# EAGLE design haptic-glove-2.1 (EAGLE 9.6.2)
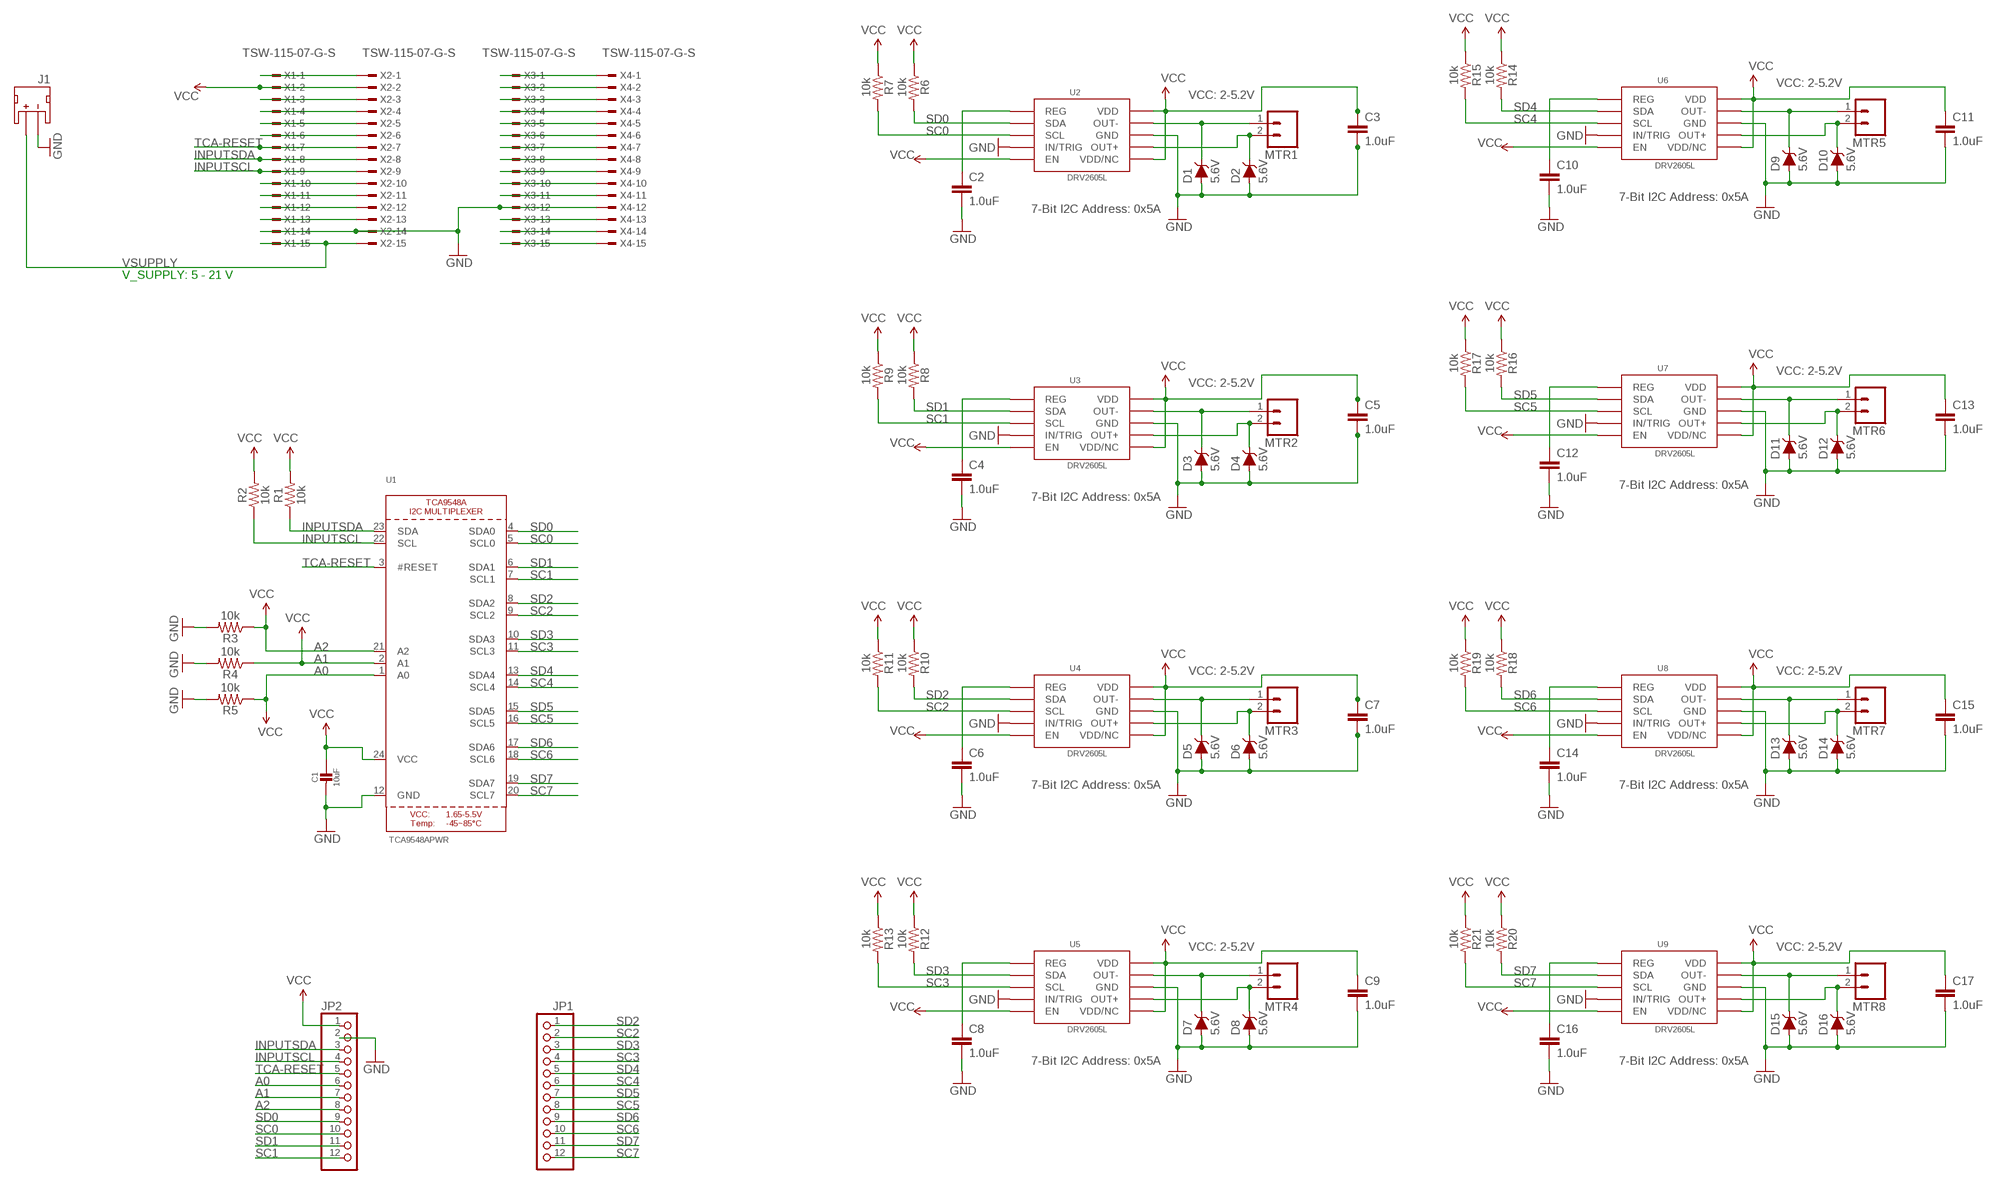
[diagram p0: schematic, sheet 1]

## Parts
C1  10uF  CAP_CERAMIC0805-NOOUTLINE  [0805-NO]
C2  1.0uF  1.0UF-16V-10%(0402)  [0402-CAP]
C3  1.0uF  1.0UF-16V-10%(0402)  [0402-CAP]
C4  1.0uF  1.0UF-16V-10%(0402)  [0402-CAP]
C5  1.0uF  1.0UF-16V-10%(0402)  [0402-CAP]
C6  1.0uF  1.0UF-16V-10%(0402)  [0402-CAP]
C7  1.0uF  1.0UF-16V-10%(0402)  [0402-CAP]
C8  1.0uF  1.0UF-16V-10%(0402)  [0402-CAP]
C9  1.0uF  1.0UF-16V-10%(0402)  [0402-CAP]
C10  1.0uF  1.0UF-16V-10%(0402)  [0402-CAP]
C11  1.0uF  1.0UF-16V-10%(0402)  [0402-CAP]
C12  1.0uF  1.0UF-16V-10%(0402)  [0402-CAP]
C13  1.0uF  1.0UF-16V-10%(0402)  [0402-CAP]
C14  1.0uF  1.0UF-16V-10%(0402)  [0402-CAP]
C15  1.0uF  1.0UF-16V-10%(0402)  [0402-CAP]
C16  1.0uF  1.0UF-16V-10%(0402)  [0402-CAP]
C17  1.0uF  1.0UF-16V-10%(0402)  [0402-CAP]
D1  5.6V  DIODE-ZENER-MMSZ5232BS  [SOD-323]
D2  5.6V  DIODE-ZENER-MMSZ5232BS  [SOD-323]
D3  5.6V  DIODE-ZENER-MMSZ5232BS  [SOD-323]
D4  5.6V  DIODE-ZENER-MMSZ5232BS  [SOD-323]
D5  5.6V  DIODE-ZENER-MMSZ5232BS  [SOD-323]
D6  5.6V  DIODE-ZENER-MMSZ5232BS  [SOD-323]
D7  5.6V  DIODE-ZENER-MMSZ5232BS  [SOD-323]
D8  5.6V  DIODE-ZENER-MMSZ5232BS  [SOD-323]
D9  5.6V  DIODE-ZENER-MMSZ5232BS  [SOD-323]
D10  5.6V  DIODE-ZENER-MMSZ5232BS  [SOD-323]
D11  5.6V  DIODE-ZENER-MMSZ5232BS  [SOD-323]
D12  5.6V  DIODE-ZENER-MMSZ5232BS  [SOD-323]
D13  5.6V  DIODE-ZENER-MMSZ5232BS  [SOD-323]
D14  5.6V  DIODE-ZENER-MMSZ5232BS  [SOD-323]
D15  5.6V  DIODE-ZENER-MMSZ5232BS  [SOD-323]
D16  5.6V  DIODE-ZENER-MMSZ5232BS  [SOD-323]
J1  JST_2MM_MALE  [JST-2-SMD]
JP1  HEADER-1X12  [1X12_ROUND]
JP2  HEADER-1X12  [1X12_ROUND]
MTR1  M02PTH  [1X02@1]
MTR2  M02PTH  [1X02@1]
MTR3  M02PTH  [1X02@1]
MTR4  M02PTH  [1X02@1]
MTR5  M02PTH  [1X02@1]
MTR6  M02PTH  [1X02@1]
MTR7  M02PTH  [1X02@1]
MTR8  M02PTH  [1X02@1]
R1  10k  10KOHM-0603-1/10W-1%  [0603]
R2  10k  10KOHM-0603-1/10W-1%  [0603]
R3  10k  10KOHM-0603-1/10W-1%  [0603]
R4  10k  10KOHM-0603-1/10W-1%  [0603]
R5  10k  10KOHM-0603-1/10W-1%  [0603]
R6  10k  10KOHM-0603-1/10W-1%  [0603]
R7  10k  10KOHM-0603-1/10W-1%  [0603]
R8  10k  10KOHM-0603-1/10W-1%  [0603]
R9  10k  10KOHM-0603-1/10W-1%  [0603]
R10  10k  10KOHM-0603-1/10W-1%  [0603]
R11  10k  10KOHM-0603-1/10W-1%  [0603]
R12  10k  10KOHM-0603-1/10W-1%  [0603]
R13  10k  10KOHM-0603-1/10W-1%  [0603]
R14  10k  10KOHM-0603-1/10W-1%  [0603]
R15  10k  10KOHM-0603-1/10W-1%  [0603]
R16  10k  10KOHM-0603-1/10W-1%  [0603]
R17  10k  10KOHM-0603-1/10W-1%  [0603]
R18  10k  10KOHM-0603-1/10W-1%  [0603]
R19  10k  10KOHM-0603-1/10W-1%  [0603]
R20  10k  10KOHM-0603-1/10W-1%  [0603]
R21  10k  10KOHM-0603-1/10W-1%  [0603]
U1  TCA9548APWR  TCA9548A  [TSSOP24]
U2  DRV2605L  [VSSOP-10]
U3  DRV2605L  [VSSOP-10]
U4  DRV2605L  [VSSOP-10]
U5  DRV2605L  [VSSOP-10]
U6  DRV2605L  [VSSOP-10]
U7  DRV2605L  [VSSOP-10]
U8  DRV2605L  [VSSOP-10]
U9  DRV2605L  [VSSOP-10]
X1  TSW-115-07-G-S  [TSW-115-XX-G-S]
X2  TSW-115-07-G-S  [TSW-115-XX-G-S]
X3  TSW-115-07-G-S  [TSW-115-XX-G-S]
X4  TSW-115-07-G-S  [TSW-115-XX-G-S]

## Nets
A0: JP2.6 R5.1 U1.1(A0) ; supply symbol labelled VCC
A1: JP2.7 R4.1 U1.2(A1) ; supply symbol labelled VCC
A2: JP2.8 R3.1 U1.21(A2) ; supply symbol labelled VCC
EN1: X3.2 X4.2
EN2: X3.4 X4.4
EN3: X3.8 X4.8
EN4: X3.11 X4.11
GND: C1.2 C2.2 C3.2 C4.2 C5.2 C6.2 C7.2 C8.2 C9.2 C10.2 C11.2 C12.2 C13.2 C14.2 C15.2 C16.2 C17.2 D1.A D2.A D3.A D4.A D5.A D6.A D7.A D8.A D9.A D10.A D11.A D12.A D13.A D14.A D15.A D16.A J1.1(-) JP2.2 R3.2 R4.2 R5.2 U1.12(GND) U2.P$4(IN/TRIG) U2.P$8(GND) U3.P$4(IN/TRIG) U3.P$8(GND) U4.P$4(IN/TRIG) U4.P$8(GND) U5.P$4(IN/TRIG) U5.P$8(GND) U6.P$4(IN/TRIG) U6.P$8(GND) U7.P$4(IN/TRIG) U7.P$8(GND) U8.P$4(IN/TRIG) U8.P$8(GND) U9.P$4(IN/TRIG) U9.P$8(GND) X1.14 X2.14 X3.12 X4.12
IN/TRIG1: X3.1 X4.1
IN/TRIG2: X3.3 X4.3
IN/TRIG3: X3.7 X4.7
IN/TRIG4: X3.10 X4.10
IN/TRIG5: X1.6 X2.6
INPUTSCL: JP2.4 R2.1 U1.22(SCL) X1.9 X2.9
INPUTSDA: JP2.3 R1.1 U1.23(SDA) X1.8 X2.8
N$1: C4.1 U3.P$1(REG)
N$2: C10.1 U6.P$1(REG)
N$3: D9.C MTR5.1 U6.P$9(OUT-)
N$4: D3.C MTR2.1 U3.P$9(OUT-)
N$5: D4.C MTR2.2 U3.P$7(OUT+)
N$6: C8.1 U5.P$1(REG)
N$7: D10.C MTR5.2 U6.P$7(OUT+)
N$8: X1.1 X2.1
N$9: D7.C MTR4.1 U5.P$9(OUT-)
N$10: D8.C MTR4.2 U5.P$7(OUT+)
N$11: C6.1 U4.P$1(REG)
N$13: X1.3 X2.3
N$14: D5.C MTR3.1 U4.P$9(OUT-)
N$15: D6.C MTR3.2 U4.P$7(OUT+)
N$16: C12.1 U7.P$1(REG)
N$17: X1.4 X2.4
N$18: D11.C MTR6.1 U7.P$9(OUT-)
N$19: D12.C MTR6.2 U7.P$7(OUT+)
N$20: C14.1 U8.P$1(REG)
N$21: X1.5 X2.5
N$22: D13.C MTR7.1 U8.P$9(OUT-)
N$23: D14.C MTR7.2 U8.P$7(OUT+)
N$24: C16.1 U9.P$1(REG)
N$25: D15.C MTR8.1 U9.P$9(OUT-)
N$26: D16.C MTR8.2 U9.P$7(OUT+)
N$28: C2.1 U2.P$1(REG)
N$29: X1.10 X2.10
N$30: X1.11 X2.11
N$31: D1.C MTR1.1 U2.P$9(OUT-)
N$32: D2.C MTR1.2 U2.P$7(OUT+)
N$34: X1.12 X2.12
N$35: X1.13 X2.13
N$46: X3.5 X4.5
N$47: X3.6 X4.6
N$50: X3.9 X4.9
N$55: X3.13 X4.13
N$58: X3.14 X4.14
N$59: X3.15 X4.15
SC0: JP2.10 R7.2 U1.5(SCL0) U2.P$2(SCL)
SC1: JP2.12 R9.2 U1.7(SCL1) U3.P$2(SCL)
SC2: JP1.2 R11.2 U1.9(SCL2) U4.P$2(SCL)
SC3: JP1.4 R13.2 U1.11(SCL3) U5.P$2(SCL)
SC4: JP1.6 R15.2 U1.14(SCL4) U6.P$2(SCL)
SC5: JP1.8 R17.2 U1.16(SCL5) U7.P$2(SCL)
SC6: JP1.10 R19.2 U1.18(SCL6) U8.P$2(SCL)
SC7: JP1.12 R21.2 U1.20(SCL7) U9.P$2(SCL)
SD0: JP2.9 R6.2 U1.4(SDA0) U2.P$3(SDA)
SD1: JP2.11 R8.2 U1.6(SDA1) U3.P$3(SDA)
SD2: JP1.1 R10.2 U1.8(SDA2) U4.P$3(SDA)
SD3: JP1.3 R12.2 U1.10(SDA3) U5.P$3(SDA)
SD4: JP1.5 R14.2 U1.13(SDA4) U6.P$3(SDA)
SD5: JP1.7 R16.2 U1.15(SDA5) U7.P$3(SDA)
SD6: JP1.9 R18.2 U1.17(SDA6) U8.P$3(SDA)
SD7: JP1.11 R20.2 U1.19(SDA7) U9.P$3(SDA)
TCA-RESET: JP2.5 U1.3(#RESET) X1.7 X2.7
VCC: C1.1 C3.1 C5.1 C7.1 C9.1 C11.1 C13.1 C15.1 C17.1 JP2.1 R1.2 R2.2 R6.1 R7.1 R8.1 R9.1 R10.1 R11.1 R12.1 R13.1 R14.1 R15.1 R16.1 R17.1 R18.1 R19.1 R20.1 R21.1 U1.24(VCC) U2.P$5(EN) U2.P$6(VDD/NC) U2.P$10(VDD) U3.P$5(EN) U3.P$6(VDD/NC) U3.P$10(VDD) U4.P$5(EN) U4.P$6(VDD/NC) U4.P$10(VDD) U5.P$5(EN) U5.P$6(VDD/NC) U5.P$10(VDD) U6.P$5(EN) U6.P$6(VDD/NC) U6.P$10(VDD) U7.P$5(EN) U7.P$6(VDD/NC) U7.P$10(VDD) U8.P$5(EN) U8.P$6(VDD/NC) U8.P$10(VDD) U9.P$5(EN) U9.P$6(VDD/NC) U9.P$10(VDD) X1.2 X2.2
VSUPPLY: J1.2(+) X1.15 X2.15
Unconnected: J1.NC1(PAD1) J1.NC2(PAD2)

## Notes on the sheet
- VCC: 2-5.2V
- VCC: 2-5.2V
- 7-Bit I2C Address: 0x5A
- 7-Bit I2C Address: 0x5A
- V_SUPPLY: 5 - 21 V
- VCC: 2-5.2V
- VCC: 2-5.2V
- 7-Bit I2C Address: 0x5A
- 7-Bit I2C Address: 0x5A
- VCC: 2-5.2V | VCC: 2-5.2V
- 7-Bit I2C Address: 0x5A | 7-Bit I2C Address: 0x5A
- VCC: 2-5.2V | VCC: 2-5.2V
- 7-Bit I2C Address: 0x5A | 7-Bit I2C Address: 0x5A

## Library data of the parts
C1 = microbuilder:CAP_CERAMIC: Ceramic Capacitors For new designs, use the packages preceded by an '_' character since they are more reliable: The following footprints should be used on most boards: _0402 - Standard footprint for regular board layouts _0603 - Standard footprint for regular board layouts _0805 - Standard footprint for regular board layouts _1206 - Standard footprint for regular board layouts For extremely tight-pitch boards where space is at a premium, the following 'micro-pitch' footprints can be used (smaller pads, no silkscreen outline, etc.): _0402MP - Micro-pitch footprint for very dense/compact boards _0603MP - Micro-pitch footprint for very dense/compact boards _0805MP - Micro-pitch footprint for very dense/compact boards _1206MP - Micro-pitch footprint for very dense/compact boards
C2-C17 = SparkFun-Capacitors:1.0UF-16V-10%(0402); MF: MURATA; MPN: GRM155R61E105KA12D; OC_NEWARK: 03AC2571; PROD_ID: CAP-12417
D1-D16 = SparkFun-DiscreteSemi:DIODE-ZENER: Zener Diode A Zener diode allows current to flow from its anode to its cathode like a normal semiconductor diode, but it also permits current to flow in the reverse direction when its "Zener voltage" is reached. - WIkipedia; PROD_ID: DIO-12442
J1 = SparkFun-Connectors:JST_2MM_MALE: JST 2MM MALE RA CONNECTOR Two pin, compact surface mount connector. Commonly used as a battery input connection point. We really like the solid locking feeling and high current rating on these small connectors. We use these all the time as battery connectors. Mates to single-cell LiPo batteries. Here is the connector we sell at SparkFun: JST Right Angle Connector - White <https://www.sparkfun.com/products/8612> (PRT-08612) Datasheet <http://www.sparkfun.com/datasheets/Prototyping/Connectors/JST-Horizontal.pdf> It was used on these SparkFun products: SparkFun MOSFET Power Controller <https://www.sparkfun.com/products/11214> (PRT-11214) SparkFun Battery Babysitter - LiPo Battery Manager <https://www.sparkfun.com/products/13777> (PRT-13777) And many, many others that required a lipo battery connection.; OC_NEWARK: unknown; PROD_ID: CONN-11443; SF_ID: PRT-08612
JP1 JP2 = microbuilder:HEADER-1X12
MTR1-MTR8 = SparkFun-Connectors:M02: Standard 2-pin 0.1" header. Use with - straight break away headers ( PRT-00116) - right angle break away headers (PRT-00553) - swiss pins (PRT-00743) - machine pins (PRT-00117) - female headers (PRT-00115) Molex polarized connector foot print use with: PRT-08233 with associated crimp pins and housings. 2.54_SCREWTERM for use with PRT-10571. 3.5mm Screw Terminal footprints for PRT-08084 5mm Screw Terminal footprints for use with PRT-08432; OC_NEWARK: unknown
R1-R21 = SparkFun-Resistors:10KOHM: 10kΩ resistor A resistor is a passive two-terminal electrical component that implements electrical resistance as a circuit element. Resistors act to reduce current flow, and, at the same time, act to lower voltage levels within circuits. - Wikipedia; OC_NEWARK: unknown; PROD_ID: RES-00824
U1 = microbuilder:TCA9548A: TCA9548A I2C Multiplexer
U2-U9 = SparkFun-PowerIC:DRV2605L; OC_NEWARK: unknown; PROD_ID: IC-13504
X1-X4 = con-samtec:TSW-115-*-G-S: THROUGH-HOLE .025" SQ POST HEADER Source: Samtec TSW.pdf; MF: Samtec Inc.; MPN: TSW-115-07-G-S

## Net classes
0 default: width 0.254 mm, drill 0.381 mm, clearance 0.178 mm

## Board
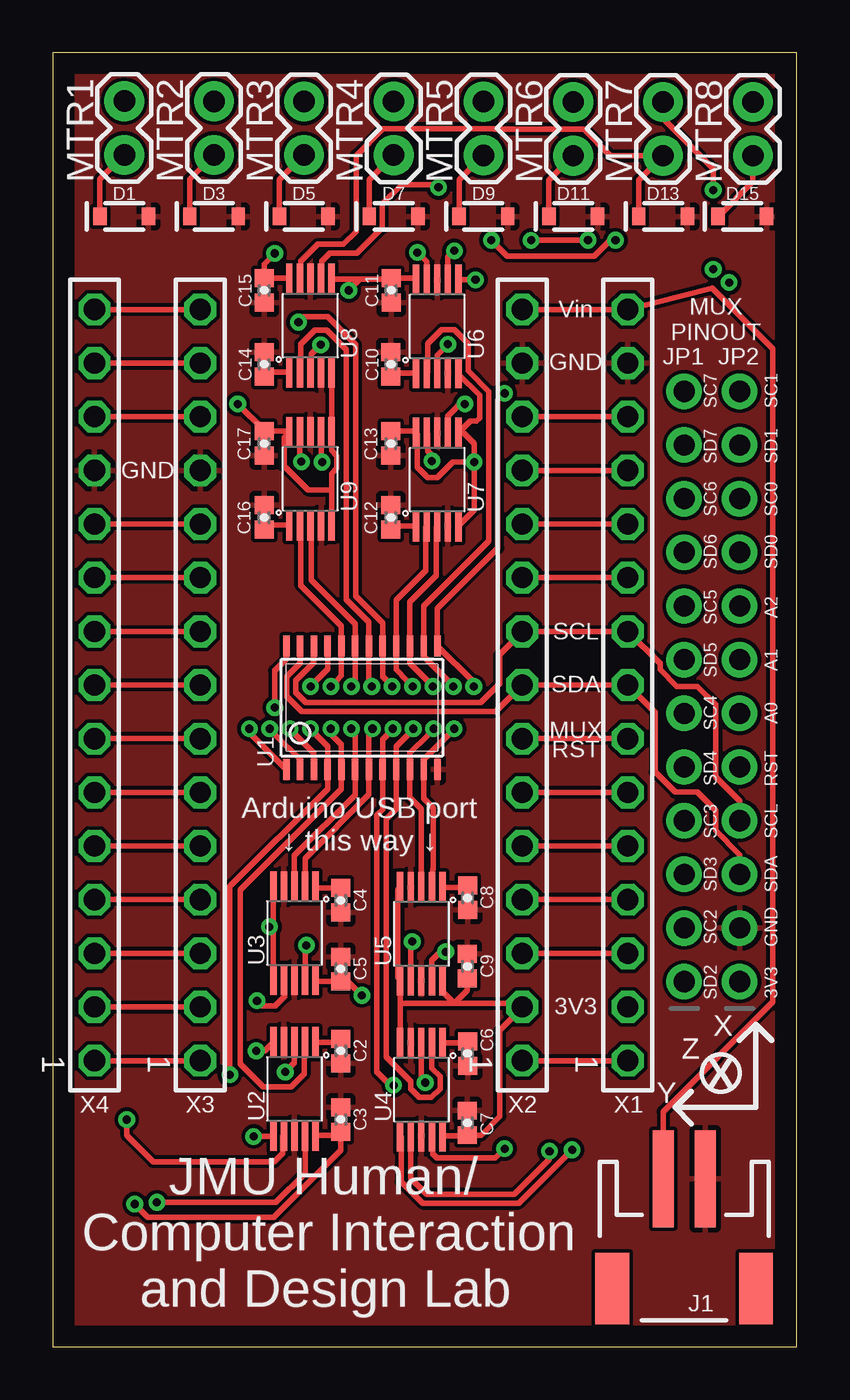
[diagram p1: board, top side]
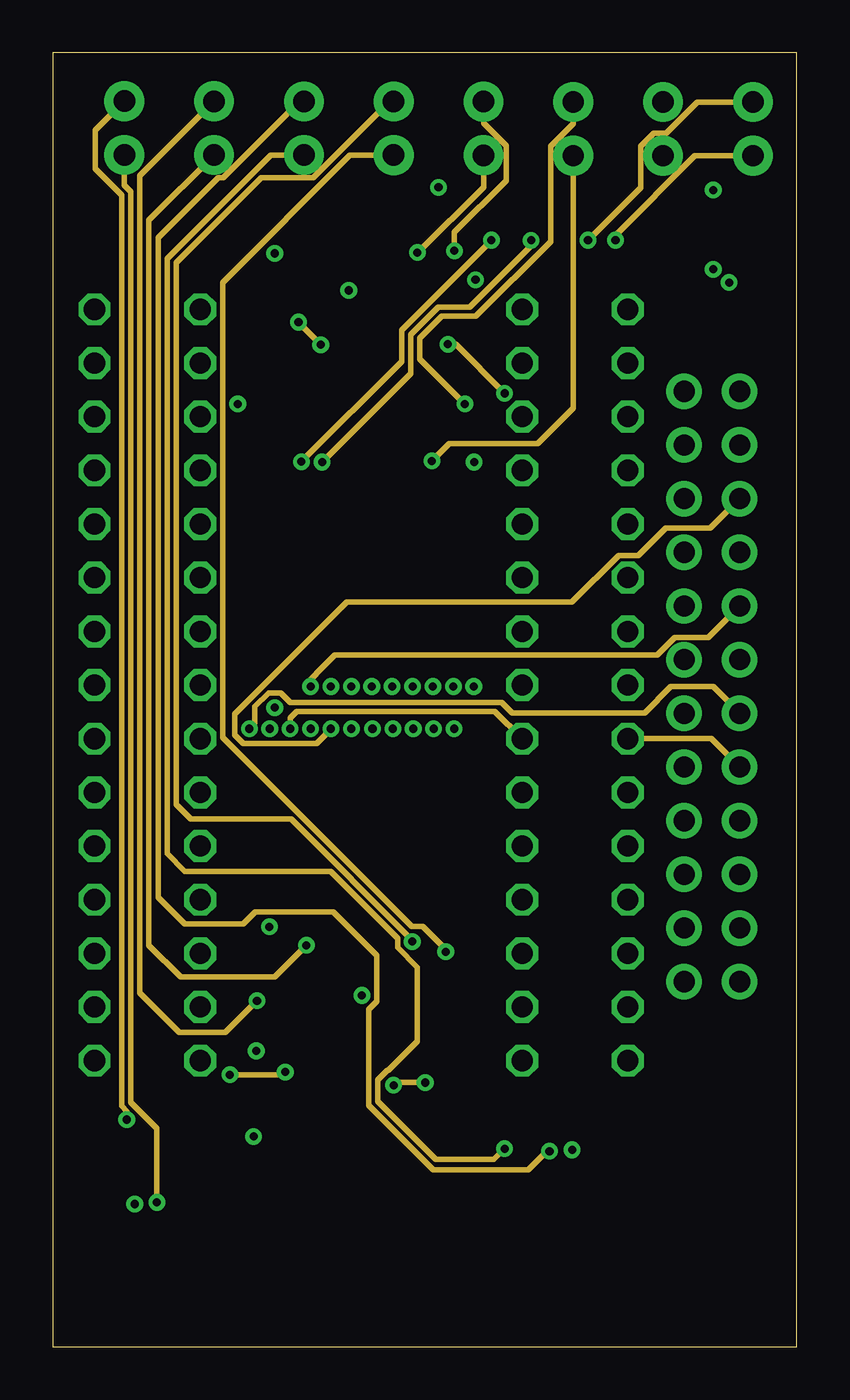
[diagram p2: board, inner layer Route2]
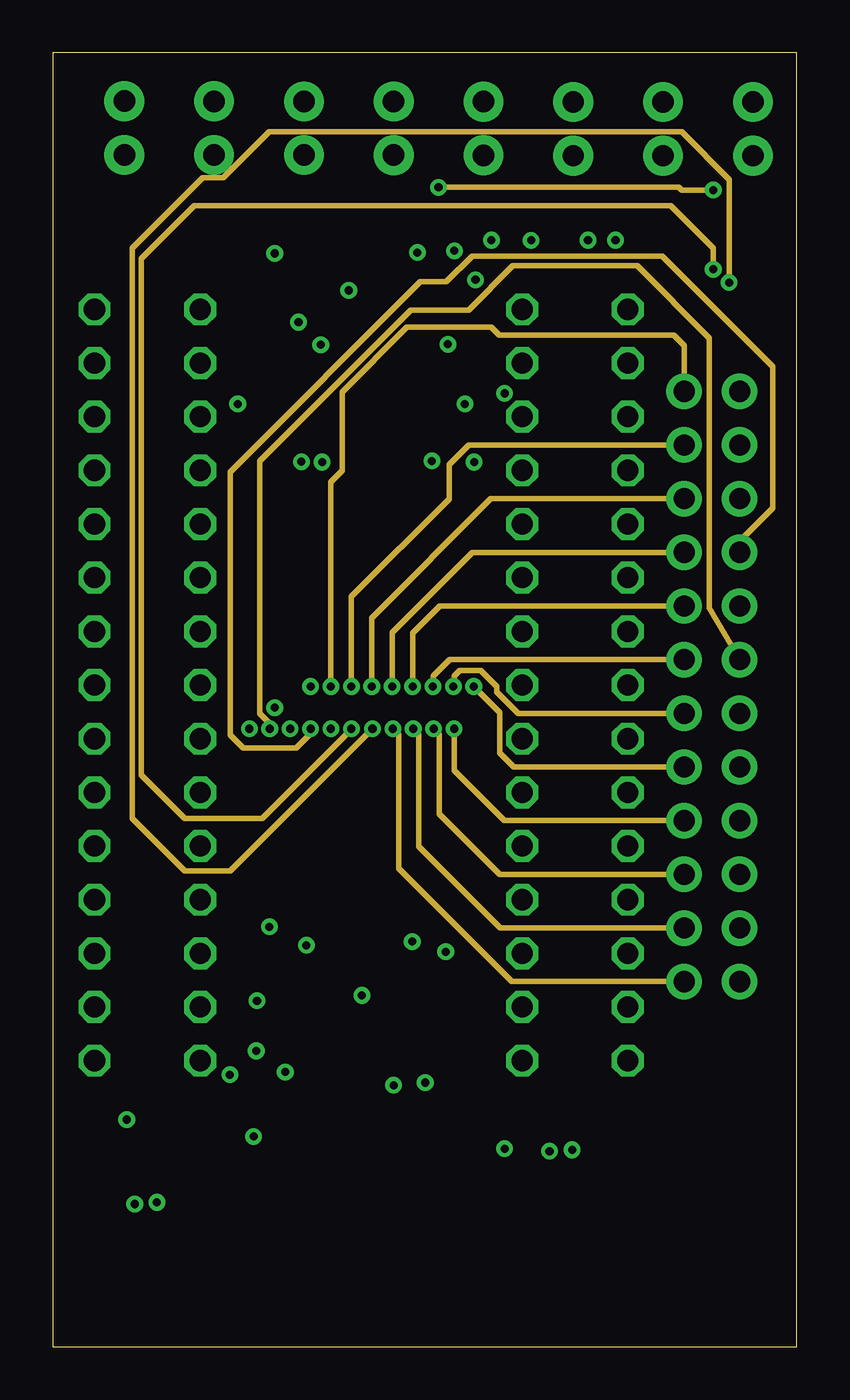
[diagram p3: board, inner layer Route15]
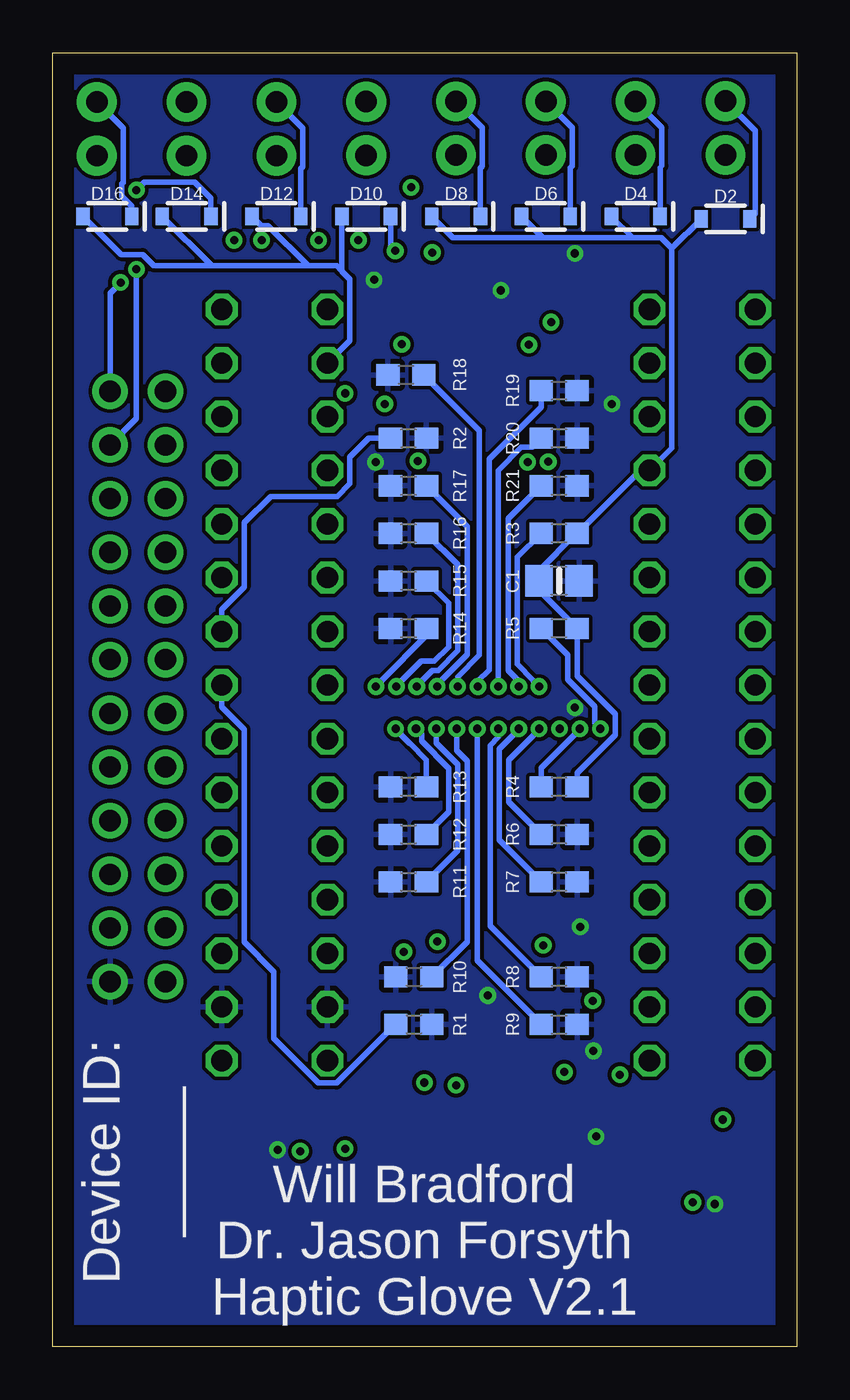
[diagram p4: board, bottom side, seen from below]

Size 35.2 x 61.24 mm. Coordinates in mm from the lower left corner, seen from the top.
Outline: 0,0 35.2,0 35.2,61.24 0,61.24 0,0
Copper layers (1+2*15+16): Top 0.035mm / dielectric 1.5mm / Route2 0.035mm / dielectric 0.15mm / Route15 0.035mm / dielectric 0.2mm / Bottom 0.035mm
Design rules "default *": minimum track width 6mil, minimum drill 0.35mm, track to track 6mil, track to pad 6mil, pad to pad 6mil, via to via 6mil, smd to smd 6mil, copper to edge 40mil, drill to drill 6mil, minimum pad ring 10mil, minimum via ring 8mil, stop-mask expansion 4mil, vias tented up to drill 0mil, thermal gap 10mil

### Footprints (pad centres in the part's own frame; a part is rotated, then mirrored left to right if it is on the bottom)
0805-NO = smd 1.3 x 1.5: 1 -0.95,0; 2 0.95,0
0402-CAP = smd 0.85 x 0.9: 1 -0.58,0; 2 0.58,0
SOD-323 = smd 0.63 x 0.83: A 1.15,0; C -1.15,0
JST-2-SMD = smd 1 x 4.6: 1 -1,-3.7; 2 1,-3.7 | smd 1.6 x 3.4: NC1 -3.4,1.5; NC2 3.4,1.5
1X12_ROUND = drill 1 pad 1.676: 1 -13.97,0; 2 -11.43,0; 3 -8.89,0; 4 -6.35,0; 5 -3.81,0; 6 -1.27,0; 7 1.27,0; 8 3.81,0; 9 6.35,0; 10 8.89,0; 11 11.43,0; 12 13.97,0
1X02@1 = drill 1.016 pad 1.88: 1 0,0; 2 2.54,0
0603 = smd 1.1 x 1: 1 -0.85,0; 2 0.85,0
TSSOP24 = smd 0.305 x 0.991: 1 -3.575,-2.918; 2 -2.925,-2.918; 3 -2.275,-2.918; 4 -1.625,-2.918; 5 -0.975,-2.918; 6 -0.325,-2.918; 7 0.325,-2.918; 8 0.975,-2.918; 9 1.625,-2.918; 10 2.275,-2.918; 11 2.925,-2.918; 12 3.575,-2.918; 13 3.575,2.918; 14 2.925,2.918; 15 2.275,2.918; 16 1.625,2.918; 17 0.975,2.918; 18 0.325,2.918; 19 -0.325,2.918; 20 -0.975,2.918; 21 -1.625,2.918; 22 -2.275,2.918; 23 -2.925,2.918; 24 -3.575,2.918
VSSOP-10 = smd 1.45 x 0.3: P$1 -1.905,1.06; P$2 -1.905,0.56; P$3 -1.905,0.06; P$4 -1.905,-0.44; P$5 -1.905,-0.94; P$6 2.495,-0.94; P$7 2.495,-0.44; P$8 2.495,0.06; P$9 2.495,0.56; P$10 2.495,1.06
TSW-115-XX-G-S = drill 1 pad 1.5 octagon: 1 17.78,0; 2 15.24,0; 3 12.7,0; 4 10.16,0; 5 7.62,0; 6 5.08,0; 7 2.54,0; 8 0,0; 9 -2.54,0; 10 -5.08,0; 11 -7.62,0; 12 -10.16,0; 13 -12.7,0; 14 -15.24,0; 15 -17.78,0

### Placement (x,y rotation side)
C1  11.25,36.25 180 bottom
C2  13.62,14 270 top
C3  13.62,10.75 90 top
C4  13.62,21.12 270 top
C5  13.62,17.88 90 top
C6  19.62,13.88 270 top
C7  19.61,10.6 90 top
C8  19.62,21.25 270 top
C9  19.61,18 90 top
C10  16,46.5 90 top
C11  16.01,50 270 top
C12  16,39.25 90 top
C13  16,42.75 270 top
C14  10,46.5 90 top
C15  10,50 270 top
C16  10,39.25 90 top
C17  10,42.75 270 top
D1  3.38,53.5 0 top
D2  3.38,53.38 180 bottom
D3  7.62,53.5 0 top
D4  7.62,53.5 180 bottom
D5  11.88,53.5 0 top
D6  11.88,53.5 180 bottom
D7  16.12,53.5 0 top
D8  16.12,53.5 180 bottom
D9  20.38,53.5 0 top
D10  20.38,53.5 180 bottom
D11  24.62,53.5 0 top
D12  24.62,53.5 180 bottom
D13  28.88,53.5 0 top
D14  28.88,53.5 180 bottom
D15  32.62,53.5 0 top
D16  32.62,53.5 180 bottom
J1  29.88,4.25 180 top
JP1  29.88,31.25 90 top
JP2  32.5,31.25 90 top
MTR1  3.38,56.41 90 top
MTR2  7.63,56.41 90 top
MTR3  11.88,56.41 90 top
MTR4  16.13,56.4 90 top
MTR5  20.38,56.4 90 top
MTR6  24.62,56.38 90 top
MTR7  28.88,56.38 90 top
MTR8  33.12,56.38 90 top
R1  18.12,15.25 0 bottom
R2  18.38,43 0 bottom
R3  11.25,38.5 0 bottom
R4  11.25,26.5 0 bottom
R5  11.25,34 0 bottom
R6  11.25,24.25 180 bottom
R7  11.25,22 180 bottom
R8  11.25,17.5 180 bottom
R9  11.25,15.25 180 bottom
R10  18.12,17.5 0 bottom
R11  18.38,22 0 bottom
R12  18.38,24.25 0 bottom
R13  18.38,26.5 0 bottom
R14  18.38,34 0 bottom
R15  18.38,36.25 0 bottom
R16  18.38,38.5 0 bottom
R17  18.38,40.75 0 bottom
R18  18.5,46 0 bottom
R19  11.25,45.25 180 bottom
R20  11.25,43 180 bottom
R21  11.25,40.75 180 bottom
U1  14.62,30.25 0 top
U2  11.38,12.5 270 top
U3  11.38,19.88 270 top
U4  17.38,12.46 270 top
U5  17.38,19.84 270 top
U6  18.25,48 90 top
U7  18.25,40.75 90 top
U8  12.25,48.03 90 top
U9  12.25,40.78 90 top
X1  27.21,31.32 270 top
X2  22.21,31.32 270 top
X3  6.97,31.32 270 top
X4  1.97,31.32 270 top

### Tracks (layer width: path | path; a pad name or v marks a point on that pad's centre or on a via)
A0  (via drill 0.38)
  Top 0.254: U1.1 9.3,29.08 v9.3,29.25
  Route2 0.254: v9.3,29.25 9.57,29.52 9.57,30.3 10.21,30.95 10.79,30.95 11.24,30.5 21.25,30.5 21.75,30 28,30 29.25,31.25 31.25,31.25 32.5,30 JP2.6
  Bottom 0.254: v9.3,29.25 9.57,29.52 9.57,30.3 10.83,31.57 10.83,32.73 R5.1
A1  (via drill 0.38)
  Top 0.254: v10.26,29.25 10.53,28.98 10.53,28.96 11.7,27.79 U1.2
  Route15 0.254: v10.26,29.25 10.26,29.5 9.8,29.96 9.8,41.91 16.95,49.06 19.67,49.06 21.77,51.16 27.65,51.16 31.06,47.74 31.06,34.96 JP2.7
  Bottom 0.254: v10.26,29.25 10.53,28.98 10.53,28.96 12.1,27.39 R4.1
A2  (via drill 0.38)
  Top 0.254: v12.2,31.25 12.46,31.52 12.46,31.54 13,32.08 U1.21
  Route2 0.254: v12.2,31.25 12.2,31.58 12.46,31.85 12.46,31.87 13.34,32.75 28.61,32.75 29.44,33.58 31.02,33.58 JP2.8
  Bottom 0.254: v12.2,31.25 12.46,31.52 12.46,31.54 13.23,32.31 13.23,37.37 R3.1
EN1
  Top 0.254: X4.2 X3.2
EN2
  Top 0.254: X4.4 X3.4
EN3
  Top 0.254: X3.8 X4.8
EN4
  Top 0.254: X3.11 X4.11
GND
  Bottom 0.254: R4.2 10.4,27.16 8.6,28.96 8.6,29.95 10.4,31.75 R5.2 12.2,35.8 C1.2 12.2,36.75 10.45,38.5 R3.2 7.42,41.48 X3.12 5.91,42.54 5.91,51.99 | D6.A 12.03,52.5 | D8.A 16.27,52.5 12.03,52.5 | D2.A 5.91,51.99 | D4.A 7.78,52.5 | 5.91,51.99 6.42,52.5 7.78,52.5 | 12.03,52.5 7.78,52.5 | D10.A 21.52,50.91 | 21.52,50.91 21.15,50.54 21.15,47.62 X2.14 | D11.A 25.35,53.07 25.03,53.07 23.12,51.16 | 21.52,50.91 21.77,51.16 23.12,51.16 | D13.A 27.68,51.16 | 27.68,51.16 23.12,51.16 | D15.A 31.97,51.7 30.96,51.7 30.42,51.16 27.68,51.16
  pour Top: -0.25,61.5 -0.25,-0.25 35.5,-0.25 35.5,61.5
IN/TRIG1
  Top 0.254: X4.1 X3.1
IN/TRIG2
  Top 0.254: X3.3 X4.3
IN/TRIG3
  Top 0.254: X3.7 X4.7
IN/TRIG4
  Top 0.254: X3.10 X4.10
IN/TRIG5
  Top 0.254: X1.6 X2.6
INPUTSCL
  Top 0.254: U1.22 12.35,32.39 11.5,31.54 11.5,30.96 11.96,30.5 20.25,30.5 21.15,31.4 21.15,32.76 22.21,33.82 X2.9 X1.9 28.73,32.34 28.73,32.05 29.53,31.25 30.5,31.25 31.36,30.39 31.36,26.97 32.5,25.82 JP2.4
  Bottom 0.254: R2.1 20.25,43 21.15,42.1 21.15,40.85 21.75,40.25 24.9,40.25 26.15,39 26.15,36 26.15,35.96 27.21,34.9 X1.9
INPUTSDA
  Top 0.254: U1.23 11.7,32.35 11.06,31.72 11.06,30.78 11.78,30.07 20.96,30.07 X2.8 X1.8 28.5,30.03 28.5,27.2 29.45,26.25 30.5,26.25 31.36,25.39 31.36,24.43 32.5,23.28 JP2.3
  Bottom 0.254: R1.1 19,15.25 21.77,12.48 22.65,12.48 24.75,14.58 24.75,17.75 26.15,19.15 26.15,29.22 27.21,30.28 X1.8
N$1
  Top 0.254: C4.1 12.51,21.7 U3.P$1
N$2
  Top 0.254: C10.1 16.18,46.09 U6.P$1
N$3  (via drill 0.38)
  Top 0.254: U6.P$9 17.69,51.35 v17.25,51.79 | D9.C 19.23,55.24 MTR5.1
  Route2 0.254: MTR5.1 20.38,54.9 17.28,51.79 v17.25,51.79
N$4  (via drill 0.38)
  Top 0.254: U3.P$9 11.94,18.93 v12,19 | D3.C 6.47,55.26 MTR2.1
  Route2 0.254: MTR2.1 4.54,53.33 4.54,19 6.04,17.5 10.5,17.5 v12,19
N$5  (via drill 0.38)
  Top 0.254: U3.P$7 10.98,17.34 10.98,16.57 10.54,16.12 9.91,16.12 v9.66,16.38
  Route2 0.254: v9.66,16.38 8.16,14.88 5.99,14.88 4.11,16.75 4.11,55.43 MTR2.2
  Bottom 0.254: D4.C 6.47,55.8 6.38,55.89 6.38,57.7 MTR2.2
N$6
  Top 0.254: C8.1 19.54,21.75 U5.P$1
N$7  (via drill 0.38)
  Top 0.254: v19,51.88 18.69,51.56 U6.P$7
  Route2 0.254: MTR5.2 20.38,57.9 21.45,56.84 21.45,55.2 19,52.76 v19,51.88
  Bottom 0.254: D10.C 19.23,52.1 v19,51.88
N$8
  Top 0.254: X1.1 X2.1
N$9  (via drill 0.38)
  Top 0.254: U5.P$9 17.93,18.29 18.34,18.7 v18.59,18.7 | D7.C 14.97,55.24 MTR4.1
  Route2 0.254: MTR4.1 14.05,56.4 8.03,50.38 8.03,28.85 16.98,19.9 17.49,19.9 18.59,18.8 v18.59,18.7
N$10  (via drill 0.38)
  Top 0.254: U5.P$7 16.93,19.11 v17.01,19.18
  Route2 0.254: MTR4.2 15.92,58.94 12.32,55.34 9.86,55.34 5.84,51.32 5.84,25.66 6.53,24.97 11.28,24.97 17.01,19.24 v17.01,19.18
  Bottom 0.254: D8.C 14.97,55.8 14.88,55.88 14.88,57.7 MTR4.2
N$11
  Top 0.254: C6.1 19.54,14.37 U4.P$1
N$13
  Top 0.254: X1.3 X2.3
N$14  (via drill 0.38)
  Top 0.254: D5.C 10.72,55.25 MTR3.1 | U4.P$9 17.98,9.93 17.98,9.12 18.16,8.94 20.94,8.94 v21.38,9.38
  Route2 0.254: MTR3.1 10.31,56.41 5.41,51.5 5.41,23.34 6.25,22.5 13.14,22.5 16.31,19.33 16.31,18.89 17.25,17.95 17.25,14.45 15.88,13.07 15.84,13.07 15.38,12.62 15.38,11.62 18.12,8.88 20.88,8.88 v21.38,9.38
N$15  (via drill 0.38)
  Top 0.254: v23.5,9.25 23.5,8.88 21.84,7.22 17.68,7.22 16.93,7.97 U4.P$7
  Route2 0.254: MTR3.2 11.67,58.95 8.07,55.34 7.82,55.34 4.98,52.5 4.98,21.27 6.25,20 9,20 9.57,20.57 13.27,20.57 15.32,18.52 15.32,16.34 14.94,15.96 14.94,11.43 18,8.38 22.5,8.38 23.38,9.25 v23.5,9.25
  Bottom 0.254: D6.C 10.72,55.8 10.63,55.89 10.63,57.7 MTR3.2
N$16
  Top 0.254: C12.1 16.18,38.84 U7.P$1
N$17
  Top 0.254: X1.4 X2.4
N$18  (via drill 0.38)
  Top 0.254: U7.P$9 17.73,43.2 17.73,42.39 17.93,42.2 v17.93,41.93 | D11.C 23.48,55.23 MTR6.1
  Route2 0.254: MTR6.1 24.62,44.44 22.94,42.75 18.75,42.75 v17.93,41.93
N$19  (via drill 0.38)
  Top 0.254: U7.P$7 18.69,44.05 19.26,44.62 v19.5,44.62
  Route2 0.254: MTR6.2 24.62,57.88 23.56,56.82 23.56,52.31 20.02,48.77 18.41,48.77 17.37,47.73 17.37,46.76 v19.5,44.62
  Bottom 0.254: D12.C 23.48,55.77 23.38,55.86 23.38,57.67 MTR6.2
N$20
  Top 0.254: C14.1 10.21,46.13 U8.P$1
N$21
  Top 0.254: X2.5 X1.5
N$22
  Top 0.254: U8.P$9 11.73,50.58 11.73,51.38 12.54,52.18 13.75,52.18 14.36,52.79 14.36,56.38 15.61,57.65 20.89,57.65 20.92,57.62 25.14,57.62 26.39,56.38 MTR7.1 27.73,55.23 D13.C
N$23  (via drill 0.38)
  Top 0.254: MTR7.2 28.88,58.13 31.25,55.76 v31.25,54.75 | v18.25,54.88 18.12,55 16.5,55 15.6,54.09 15.6,52.96 14.39,51.75 13.1,51.75 12.73,51.38 12.73,50.58 U8.P$7
  Route15 0.254: v18.25,54.88 29.62,54.88 29.75,54.75 v31.25,54.75
  Bottom 0.254: D14.C 27.73,54.35 28.5,55.13 30.87,55.13 v31.25,54.75
N$24
  Top 0.254: C16.1 10.21,38.88 U9.P$1
N$25  (via drill 0.38)
  Top 0.254: v26.62,52.38 26.38,52.38 25.62,51.62 21.5,51.62 v20.75,52.38 | U9.P$9 11.69,41.96 v11.76,41.89 | D15.C 33.12,55.15 MTR8.1
  Route2 0.254: MTR8.1 30.38,56.38 26.62,52.62 v26.62,52.38 | v20.75,52.38 20.75,52.36 16.51,48.12 16.51,46.63 v11.76,41.89
N$26  (via drill 0.38)
  Top 0.254: v25.32,52.38 v22.64,52.38 v22.63,52.37 | U9.P$7 12.69,41.93 v12.74,41.88
  Route2 0.254: MTR8.2 30.49,58.91 29.02,57.44 28.43,57.44 27.81,56.82 27.81,54.86 v25.32,52.38 | v22.63,52.37 22.63,52.12 19.72,49.2 18.23,49.2 16.94,47.91 16.94,46.07 v12.74,41.88
  Bottom 0.254: D16.C 31.48,53.99 31.95,54.46 31.95,55.04 31.88,55.11 31.88,57.67 MTR8.2
N$28
  Top 0.254: C2.1 13.45,14.4 U2.P$1
N$29
  Top 0.254: X1.10 X2.10
N$30
  Top 0.254: X1.11 X2.11
N$31  (via drill 0.38)
  Top 0.254: v4.93,6.83 10.55,6.83 11.94,8.22 U2.P$9 | D1.C 2.23,55.26 MTR1.1
  Route2 0.254: MTR1.1 3.38,54.98 3.68,54.68 3.68,11.57 4.93,10.32 v4.93,6.83
N$32  (via drill 0.38)
  Top 0.254: U2.P$7 10.89,9.96 10.89,9.15 10.49,8.75 4.75,8.75 3.5,10 v3.5,10.75
  Route2 0.254: MTR1.2 2,57.58 2,55.75 3.25,54.5 3.25,11.39 3.5,11.14 v3.5,10.75
  Bottom 0.254: D2.C 1.98,53.62 1.98,57.55 MTR1.2
N$34
  Top 0.254: X1.12 X2.12
N$35
  Top 0.254: X1.13 X2.13
N$46
  Top 0.254: X4.5 X3.5
N$47
  Top 0.254: X3.6 X4.6
N$50
  Top 0.254: X4.9 X3.9
N$55
  Top 0.254: X3.13 X4.13
N$58
  Top 0.254: X4.14 X3.14
N$59
  Top 0.254: X3.15 X4.15
SC0  (via drill 0.38)
  Top 0.254: v13.16,29.25 13.16,29 13.65,28.51 U1.5 13.65,26.4 8.88,21.63 8.88,13.39 9.96,12.3 11.29,12.3 11.89,12.9 11.89,14.36 U2.P$2
  Route2 0.254: v13.16,29.25 12.89,28.98 12.89,28.96 12.48,28.55 9.01,28.55 8.6,28.96 8.6,29.95 13.9,35.25 24.56,35.25 26.77,37.46 27.71,37.46 29,38.75 31.11,38.75 JP2.10
  Bottom 0.254: v13.16,29.25 13.16,29.2 14.07,28.29 14.07,23.98 R7.2
SC1  (via drill 0.38)
  Top 0.254: U3.P$2 11.94,23.11 14.95,26.13 U1.7 14.95,29.07 v15.12,29.25
  Route15 0.254: v15.12,29.25 8.38,22.51 6.25,22.51 3.75,25.01 3.75,52 7.09,55.34 8.07,55.34 10.23,57.5 29.75,57.5 32,55.25 v32,50.38
  Bottom 0.254: R9.2 15.12,18.27 v15.12,29.25 | v32,50.38 32.5,49.88 JP2.12
SC2  (via drill 0.38)
  Top 0.254: v17.05,29.25 16.79,28.98 16.79,28.96 16.25,28.42 U1.9 16.25,25.46 15.77,24.98 15.77,13.72 16.93,12.56 16.93,12.21 17.34,11.8 17.91,11.8 18.32,12.21 18.32,12.79 17.93,13.18 U4.P$2
  Route15 0.254: v17.05,29.25 17.32,28.98 17.32,23.68 21.18,19.82 JP1.2
  Bottom 0.254: v17.05,29.25 17.05,28.57 16.04,27.55 16.04,23.49 R11.2
SC3  (via drill 0.38)
  Top 0.254: U5.P$2 17.98,21.79 17.98,22.6 18,22.62 18,25.5 17.55,25.95 U1.11 17.55,27.79 18.72,28.96 18.72,28.98 v18.99,29.25
  Route15 0.254: JP1.4 21.35,24.9 18.99,27.26 v18.99,29.25
  Bottom 0.254: v18.99,29.25 18.72,28.98 18.72,28.96 18.31,28.55 18.3,28.55 17.52,27.77 R13.2
SC4  (via drill 0.38)
  Top 0.254: v18.95,31.25 18.68,31.52 18.68,31.54 17.55,32.67 U1.14 17.55,35.05 20.63,38.13 20.63,45.22 19.64,46.2 19.64,47.48 18.98,48.14 18.41,48.14 17.73,47.47 17.73,46.14 U6.P$2
  Route15 0.254: v18.95,31.25 19,31.3 19,31.75 19.25,32 20.25,32 21,31.25 21,31 22.02,29.98 JP1.6
  Bottom 0.254: v18.95,31.25 18.68,31.52 18.68,31.54 17.78,32.45 17.15,32.45 16.47,33.12 16.47,35.2 R15.2
SC5  (via drill 0.38)
  Top 0.254: v17.02,31.25 16.75,31.52 16.75,31.54 16.25,32.04 U1.16 16.25,35.35 17.64,36.74 17.64,38.8 U7.P$2
  Route15 0.254: v17.02,31.25 17.02,33.77 18.31,35.06 JP1.8
  Bottom 0.254: v17.02,31.25 17.02,31.35 15.61,32.77 15.61,38.83 R17.2
SC6  (via drill 0.38)
  Top 0.254: v15.09,31.25 14.95,31.39 U1.18 14.95,34.3 13.89,35.35 13.89,47.2 12.97,48.12 12.39,48.12 11.73,47.47 11.73,46.17 U8.P$2
  Route15 0.254: v15.09,31.25 15.09,34.5 20.73,40.14 JP1.10
  Bottom 0.254: v15.09,31.25 15.09,31.5 14.56,32.03 14.56,42.02 12.1,44.48 R19.2
SC7  (via drill 0.38)
  Top 0.254: U9.P$2 11.73,38.84 11.73,36.03 13.65,34.11 U1.20 13.65,31.76 13.43,31.54 13.43,31.52 v13.16,31.25
  Route15 0.254: v13.16,31.25 13.16,40.93 13.69,41.46 13.69,45.19 16.75,48.25 20.75,48.25 21.12,47.88 29.38,47.88 29.88,47.38 JP1.12
  Bottom 0.254: v13.16,31.25 13.16,31.5 13.66,32 13.66,39.19 R21.2
SD0  (via drill 0.38)
  Top 0.254: v12.2,29.25 12.46,28.98 12.46,28.96 13,28.42 U1.4 13,26.4 8.38,21.78 v8.38,12.88 | U2.P$3 11.44,13.44 v11,13
  Route2 0.254: v11,13 10.88,12.88 v8.38,12.88
  Route15 0.254: v12.2,29.25 12.2,29.02 11.52,28.34 9.01,28.34 8.39,28.96 8.39,41.4 17.39,50.4 18.63,50.4 19.84,51.61 28.84,51.61 34.06,46.39 34.06,39.7 32.5,38.14 JP2.9
  Bottom 0.254: v12.2,29.25 12.2,29.22 13.64,27.78 13.64,25.79 R6.2
SD1  (via drill 0.38)
  Top 0.254: U3.P$3 11.44,23.26 14.3,26.13 U1.6 14.3,29.07 v14.12,29.25
  Route15 0.254: v14.12,29.25 13.86,28.98 13.86,28.96 9.9,25 6.25,25 4.18,27.07 4.18,51.5 6.68,54 29.25,54 31.25,52 v31.25,51
  Bottom 0.254: v14.12,29.25 14.12,28.85 14.51,28.47 14.51,19.91 R8.2 | JP2.11 31.25,43.93 v31.25,51
SD2  (via drill 0.38)
  Top 0.254: v16.09,29.25 15.82,28.98 15.82,28.96 15.6,28.74 U1.8 15.6,25.42 15.34,25.16 15.34,13.01 15.97,12.38 v16.12,12.38 | U4.P$3 17.43,12.69 v17.62,12.5
  Route2 0.254: v17.62,12.5 16.25,12.5 v16.12,12.38
  Route15 0.254: v16.09,29.25 16.36,28.98 16.36,22.64 21.72,17.28 JP1.1
  Bottom 0.254: v16.09,29.25 16.09,28.22 15.61,27.73 15.61,19.17 R10.2
SD3  (via drill 0.38)
  Top 0.254: U5.P$3 17.43,25.45 16.9,25.99 U1.10 16.9,28.11 17.75,28.96 17.75,28.98 v18.02,29.25
  Route15 0.254: v18.02,29.25 18.29,28.98 18.29,25.21 21.14,22.36 JP1.3
  Bottom 0.254: v18.02,29.25 17.75,28.98 17.75,28.66 16.47,27.38 16.47,25.3 R12.2
SD4  (via drill 0.38)
  Top 0.254: v19.92,31.25 19.92,31.45 U1.13 18.2,34.95 21.06,37.81 21.06,44.81 v21.38,45.12 | v18.7,47.45 18.19,46.94 U6.P$3
  Route2 0.254: v18.7,47.45 19.05,47.45 v21.38,45.12
  Route15 0.254: v19.92,31.25 21.15,30.02 21.15,28.1 21.81,27.44 JP1.5
  Bottom 0.254: v19.92,31.25 19.65,31.52 19.65,31.54 17.52,33.66 R14.2
SD5  (via drill 0.38)
  Top 0.254: v17.99,31.25 17.72,31.52 17.72,31.54 16.9,32.36 U1.15 16.9,35.25 18.14,36.49 18.14,38.8 U7.P$3
  Route15 0.254: v17.99,31.25 18,31.26 18,31.75 18.77,32.52 JP1.7
  Bottom 0.254: v17.99,31.25 17.93,31.31 17.93,31.33 17.25,32.01 16.97,32.01 16.04,32.95 16.04,37.01 R16.2
SD6  (via drill 0.38)
  Top 0.254: v16.05,31.25 15.79,31.52 15.79,31.54 15.6,31.73 U1.17 15.6,34.26 14.33,35.53 14.33,47.42 13,48.75 11.88,48.75 v11.62,48.5 | U8.P$3 12.23,46.17 12.23,46.98 v12.68,47.43
  Route2 0.254: v12.68,47.43 11.62,48.48 v11.62,48.5
  Route15 0.254: v16.05,31.25 16.05,33.8 19.85,37.6 JP1.9
  Bottom 0.254: v16.05,31.25 16.05,31.71 15.02,32.74 15.02,43.37 R18.2
SD7  (via drill 0.38)
  Top 0.254: v14.12,31.25 14.3,31.43 U1.19 14.3,34.21 12.23,36.28 12.23,38.84 U9.P$3
  Route15 0.254: v14.12,31.25 14.12,35.5 18.75,40.12 18.75,41.75 19.68,42.68 JP1.11
  Bottom 0.254: R20.2 12.53,42.57 13.03,42.57 14.12,41.48 v14.12,31.25
TCA-RESET  (via drill 0.38)
  Top 0.254: X1.7 X2.7 | v11.23,29.25 11.5,28.98 11.5,28.96 12.35,28.11 U1.3
  Route2 0.254: v11.23,29.25 11.23,29.76 11.54,30.07 20.92,30.07 X2.7 | X1.7 31.16,28.78 JP2.5
VCC  (via drill 0.38)
  Top 0.254: U5.P$5 16.31,21.62 16.31,17.47 U5.P$6 16.43,16.25 | U3.P$6 10.44,19.69 v10.25,19.88 10.44,20.06 U3.P$5 | 16.43,16.25 U4.P$5 | U2.P$10 13.46,10.01 C3.1 13.62,9.29 10.46,6.12 4.5,6.12 v3.88,6.75 | U4.P$10 19.57,9.97 C7.1 20.26,10.02 21.15,10.9 21.15,14.98 22.21,16.04 X2.2 21.38,16.25 19,16.25 | 19.86,17.43 C9.1 19.61,16.86 19,16.25 | U1.24 11.05,32.55 10.5,32 v10.5,30.25 | 13.19,40.55 U9.P$5 | U6.P$5 19.19,46.05 20.2,45.04 20.2,43.96 20.04,43.8 19.75,43.8 U7.P$6 19.44,43.24 19.94,42.74 v19.94,41.88 | U8.P$5 U9.P$6 13.19,42.41 13.44,42.16 13.44,41.59 13.19,41.34 13.19,40.55 | U8.P$10 11.14,50.58 C15.1 10,51.25 v10.5,51.75 | U6.P$10 17.11,50.58 C11.1 15.96,50.53 14.5,50.53 | U8.P$6 14.5,50.53 | U6.P$6 v20,50.5 | v8.75,44.62 10,43.38 C17.1 11.14,43.33 U9.P$10 10.94,43.03 10.94,41.69 12.08,40.55 13.19,40.55 | 16.43,16.25 19,16.25 | v19.94,41.88 19.94,41.87 | v19.94,41.88 v19.93,41.88 | C13.1 17.11,43.33 U7.P$10 17.23,43.2 17.23,41.64 17.74,41.13 18.19,41.13 18.93,41.88 v19.93,41.88 | U3.P$10 12.52,17.3 C5.1 13.96,17.3 v14.62,16.62 | v19.93,41.88 19.94,41.87 | U7.P$5 19.94,39.59 19.94,41.87 | 14.5,50.53 14.5,50.5 v14,50 | U2.P$6 10.38,9.95 v9.5,9.95 | U5.P$10 18.43,16.82 19,16.25 | U2.P$5 10.03,14 v9.62,14 | U4.P$6 16.48,9.93 16.48,7.81 17.51,6.79 22.04,6.79 v24.57,9.32
  pour Bottom: -0.25,61.5 -0.25,-0.25 35.5,-0.25 35.5,61.5
VSUPPLY
  Top 0.254: X2.15 X1.15 31.21,50.1 34.06,47.25 34.06,16.31 28.88,11.12 J1.2

### Text on the board
tNames: Vin | MUX / PINOUT | GND | SC7 | SC1 | SD7 | SD1 | GND | SC6 | SC0 | SD6 | SD0 | SC5 | A2 | SCL | SD5 | A1 | SDA | SC4 | A0 | MUX / RST | SD4 | RST | Arduino USB port / ↓ this way ↓ | SC3 | SCL | SD3 | SDA | SC2 | GND | SD2 | 3V3 | 3V3 | X | Z | X | Y | JMU Human/ / Computer Interaction / and Design Lab
bNames: Device ID: / _____ | Will Bradford / Dr. Jason Forsyth / Haptic Glove V2.1